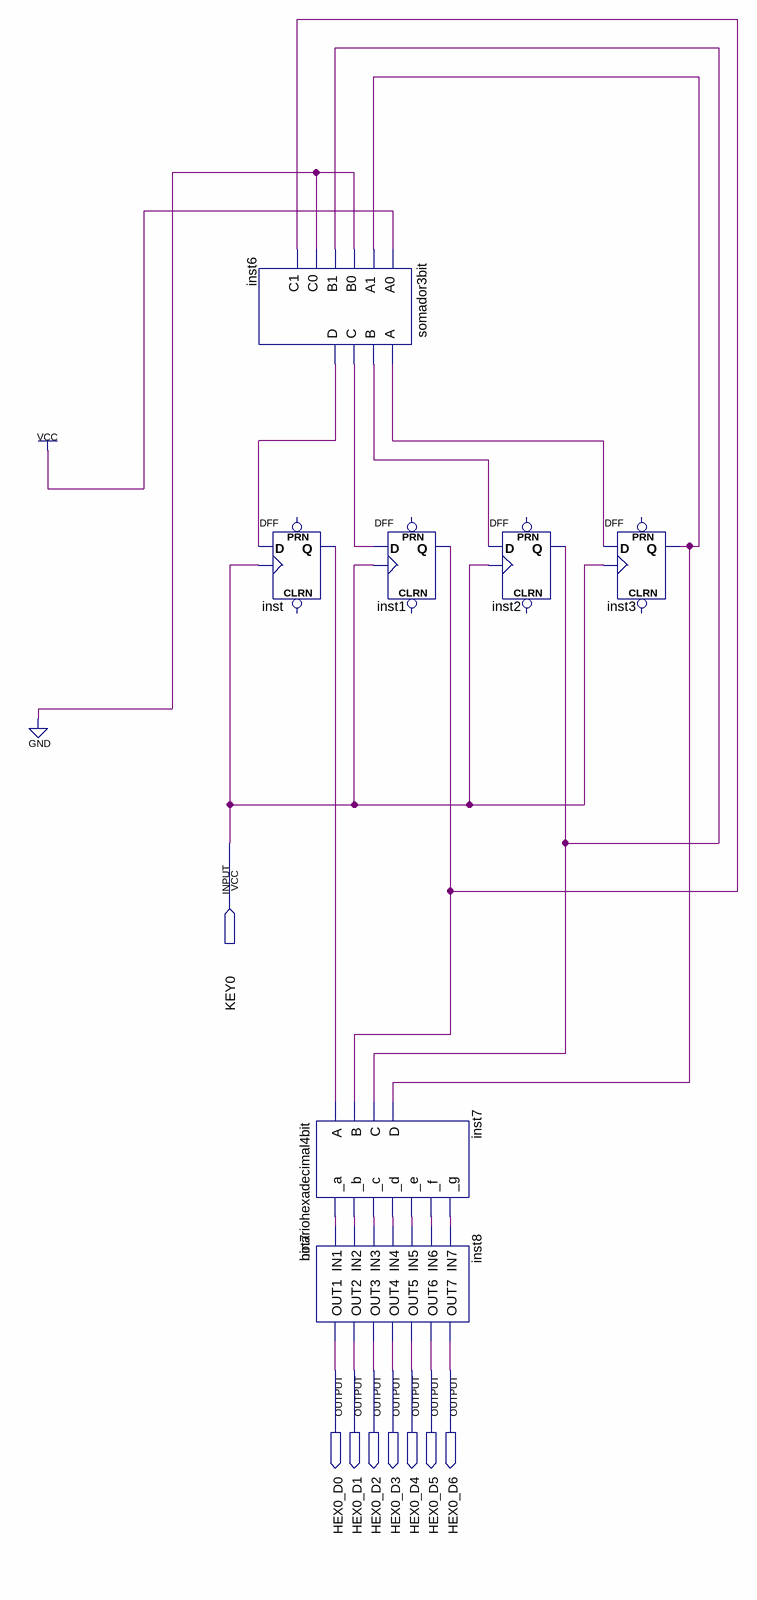
[diagram p0: schematic sheet]
// Quartus schematic main.bdf as structural Verilog: 7 symbols, 8 pins
module main (
  input  KEY0,
  output HEX0_D0,
  output HEX0_D1,
  output HEX0_D2,
  output HEX0_D3,
  output HEX0_D4,
  output HEX0_D5,
  output HEX0_D6
);

  wire inst1_q, inst2_q, inst3_q, inst6_a, inst6_b, inst6_c, inst6_d, inst7__a, inst7__b, inst7__c, inst7__d,
       inst7__e, inst7__f, inst7__g, inst_q;

  somador3bit inst6 (
    .A0(1'b1), .A1(inst3_q), .B0(1'b0), .B1(inst2_q), .C0(1'b0), .C1(inst1_q), .A(inst6_a), .B(inst6_b),
    .C(inst6_c), .D(inst6_d));
  DFF inst (.CLK(KEY0), .D(inst6_d), .Q(inst_q));  // open: CLRN, PRN
  binariohexadecimal4bit inst7 (
    .A(inst_q), .B(inst1_q), .C(inst2_q), .D(inst3_q), ._a(inst7__a), ._b(inst7__b), ._c(inst7__c),
    ._d(inst7__d), ._e(inst7__e), ._f(inst7__f), ._g(inst7__g));
  not7 inst8 (
    .IN1(inst7__a), .IN2(inst7__b), .IN3(inst7__c), .IN4(inst7__d), .IN5(inst7__e), .IN6(inst7__f),
    .IN7(inst7__g), .OUT1(HEX0_D0), .OUT2(HEX0_D1), .OUT3(HEX0_D2), .OUT4(HEX0_D3), .OUT5(HEX0_D4),
    .OUT6(HEX0_D5), .OUT7(HEX0_D6));
  DFF inst1 (.CLK(KEY0), .D(inst6_c), .Q(inst1_q));  // open: CLRN, PRN
  DFF inst2 (.CLK(KEY0), .D(inst6_b), .Q(inst2_q));  // open: CLRN, PRN
  DFF inst3 (.CLK(KEY0), .D(inst6_a), .Q(inst3_q));  // open: CLRN, PRN
endmodule
